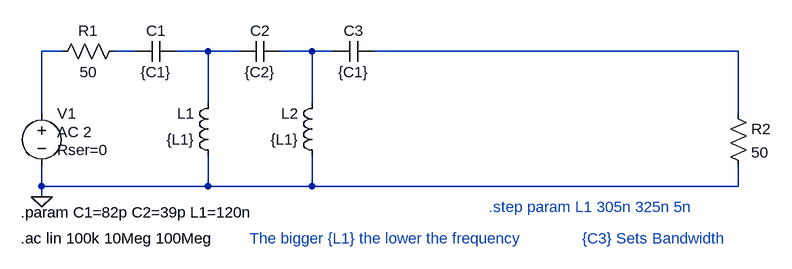
[diagram p0: schematic HighPass.asc]
HighPass.asc, the LTspice schematic file:
Version 4
SHEET 1 880 680
WIRE -736 -336 -768 -336
WIRE -624 -336 -656 -336
WIRE -512 -336 -560 -336
WIRE -464 -336 -512 -336
WIRE -352 -336 -400 -336
WIRE -320 -336 -352 -336
WIRE 304 -336 -256 -336
WIRE -512 -256 -512 -336
WIRE -352 -256 -352 -336
WIRE -768 -240 -768 -336
WIRE 304 -240 304 -336
WIRE -768 -128 -768 -160
WIRE -512 -128 -512 -176
WIRE -512 -128 -768 -128
WIRE -352 -128 -352 -176
WIRE -352 -128 -512 -128
WIRE 304 -128 304 -160
WIRE 304 -128 -352 -128
WIRE -768 -112 -768 -128
FLAG -768 -112 0
SYMBOL ind -496 -160 R180
WINDOW 0 36 80 Left 2
WINDOW 3 36 40 Left 2
SYMATTR InstName L1
SYMATTR Value {L1}
SYMBOL voltage -768 -256 R0
WINDOW 3 24 44 Left 2
WINDOW 123 24 44 Left 2
WINDOW 39 24 72 Left 2
SYMATTR Value ""
SYMATTR Value2 AC 2
SYMATTR SpiceLine Rser=0
SYMATTR InstName V1
SYMBOL cap -560 -352 R90
WINDOW 0 0 32 VBottom 2
WINDOW 3 32 32 VTop 2
SYMATTR InstName C1
SYMATTR Value {C1}
SYMBOL res -752 -320 R270
WINDOW 0 32 56 VTop 2
WINDOW 3 0 56 VBottom 2
SYMATTR InstName R1
SYMATTR Value 50
SYMBOL res 288 -256 R0
SYMATTR InstName R2
SYMATTR Value 50
SYMBOL cap -400 -352 R90
WINDOW 0 0 32 VBottom 2
WINDOW 3 32 32 VTop 2
SYMATTR InstName C2
SYMATTR Value {C2}
SYMBOL cap -256 -352 R90
WINDOW 0 0 32 VBottom 2
WINDOW 3 32 32 VTop 2
SYMATTR InstName C3
SYMATTR Value {C1}
SYMBOL ind -336 -160 R180
WINDOW 0 36 80 Left 2
WINDOW 3 36 40 Left 2
SYMATTR InstName L2
SYMATTR Value {L1}
TEXT -800 -48 Left 2 !.ac lin 100k 10Meg 100Meg
TEXT -800 -88 Left 2 !.param C1=82p C2=39p L1=120n
TEXT -80 -96 Left 2 ;.step param L1 305n 325n 5n
TEXT 64 -48 Left 2 ;{C3} Sets Bandwidth
TEXT -448 -48 Left 2 ;The bigger {L1} the lower the frequency

The netlist it stands for:
* HighPass.asc
L1 0 N003 {L1}
V1 N001 0 AC 2 Rser=0
C1 N003 N002 {C1}
R1 N001 N002 50
R2 N005 0 50
C2 N004 N003 {C2}
C3 N005 N004 {C1}
L2 0 N004 {L1}
.ac lin 100k 10Meg 100Meg
.param C1=82p C2=39p L1=120n
* .step param L1 305n 325n 5n
* {C3} Sets Bandwidth
* The bigger {L1} the lower the frequency
.backanno
.end